# Altium project MachSacXa.PrjPcb
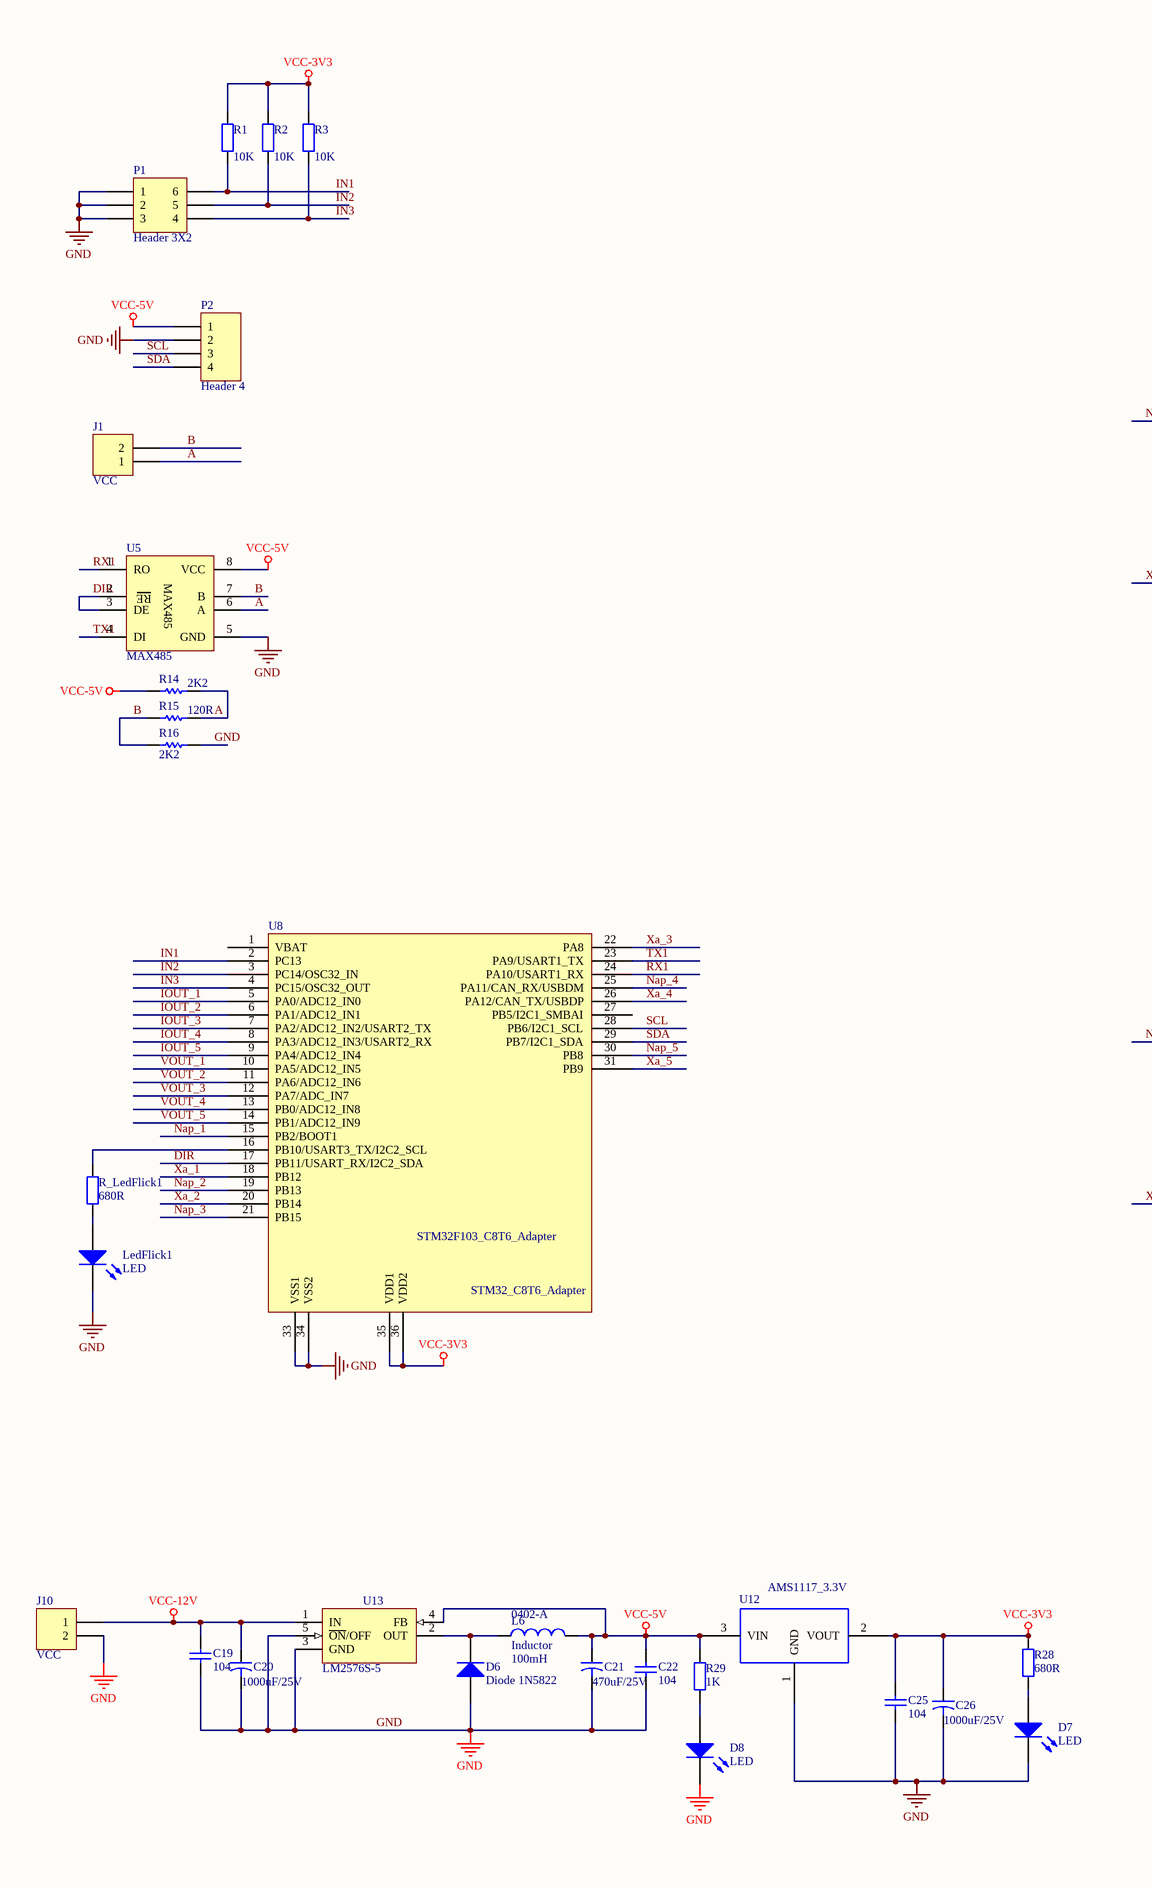
[diagram p0: MachSacXa.SchDoc, left]
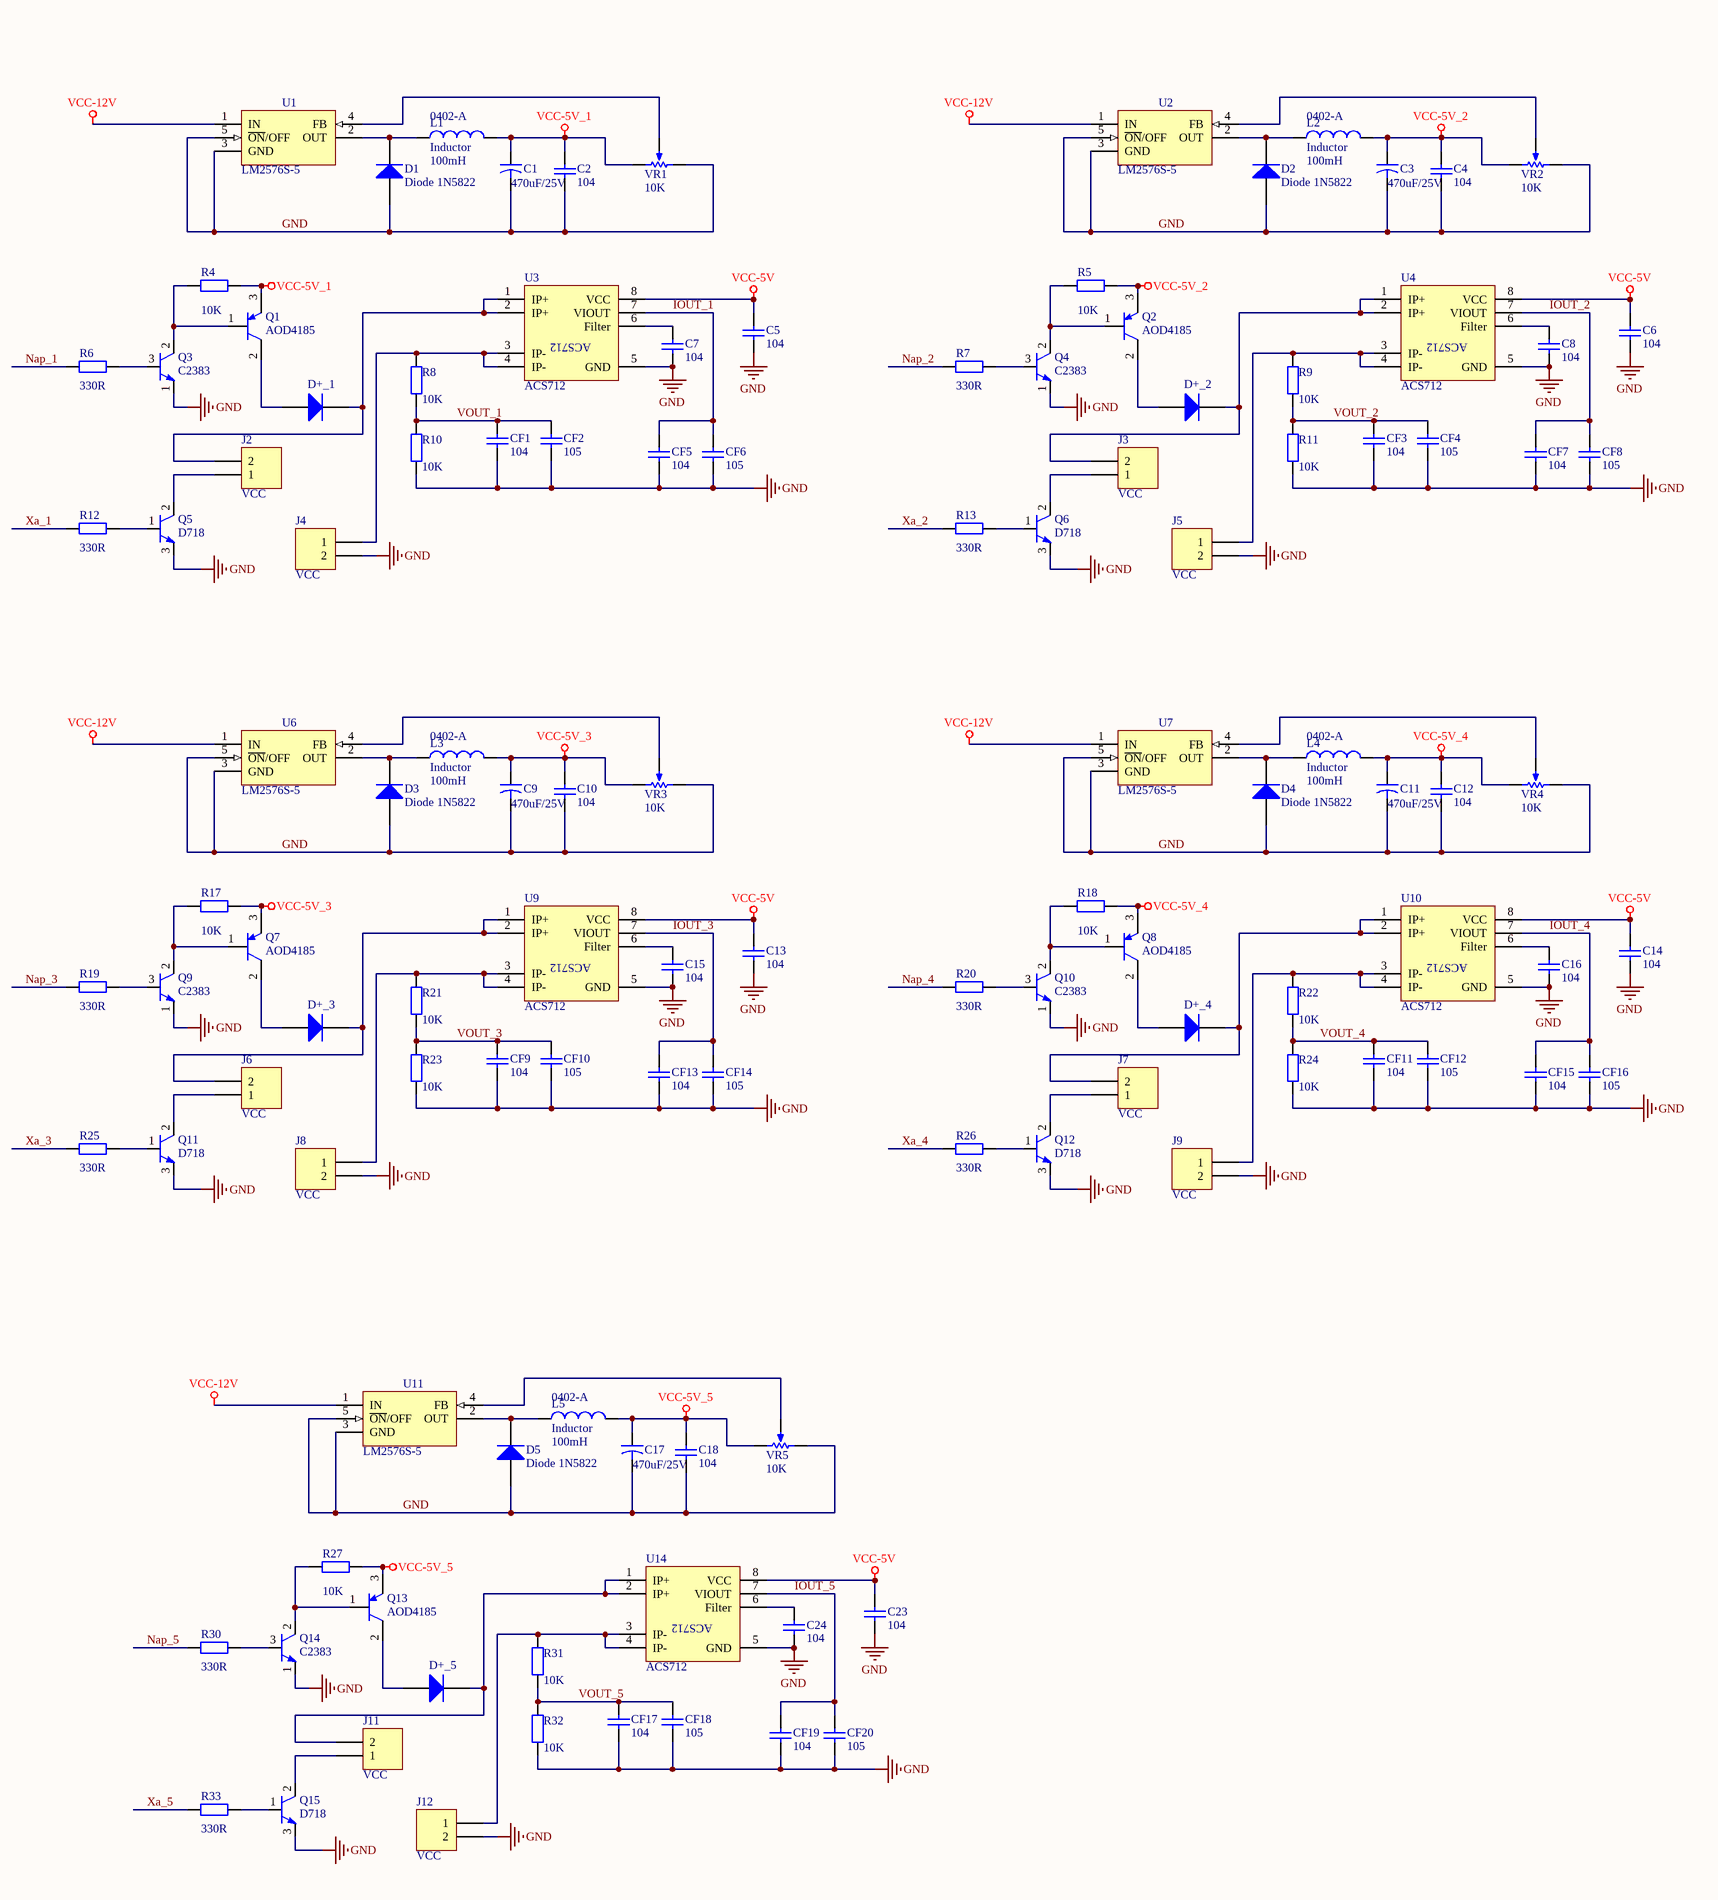
[diagram p1: MachSacXa.SchDoc, right]
1 sheet, 148 parts. Net scope: global (net labels, ports and power ports of the same name join across sheets).
Board file: MachSacXa.PcbDoc

## Sheet MachSacXa.SchDoc
size A2

### Parts
C1  value 470uF/25V  [C_D300]
C2  104  [R/C_0805]
C3  value 470uF/25V  [C_D300]
C4  104  [R/C_0805]
C5  104  [R/C_0805]
C6  104  [R/C_0805]
C7  104  [R/C_0805]
C8  104  [R/C_0805]
C9  value 470uF/25V  [C_D300]
C10  104  [R/C_0805]
C11  value 470uF/25V  [C_D300]
C12  104  [R/C_0805]
C13  104  [R/C_0805]
C14  104  [R/C_0805]
C15  104  [R/C_0805]
C16  104  [R/C_0805]
C17  value 470uF/25V  [C_D300]
C18  104  [R/C_0805]
C19  104  [R/C_0805]
C20  value 1000uF/25V  [C_D300]
C21  value 470uF/25V  [C_D300]
C22  104  [R/C_0805]
C23  104  [R/C_0805]
C24  104  [R/C_0805]
C25  104  [R/C_0805]
C26  value 1000uF/25V  [C_D300]
CF1  104  [R/C_0805]
CF2  105  [R/C_0805]
CF3  104  [R/C_0805]
CF4  105  [R/C_0805]
CF5  104  [R/C_0805]
CF6  105  [R/C_0805]
CF7  104  [R/C_0805]
CF8  105  [R/C_0805]
CF9  104  [R/C_0805]
CF10  105  [R/C_0805]
CF11  104  [R/C_0805]
CF12  105  [R/C_0805]
CF13  104  [R/C_0805]
CF14  105  [R/C_0805]
CF15  104  [R/C_0805]
CF16  105  [R/C_0805]
CF17  104  [R/C_0805]
CF18  105  [R/C_0805]
CF19  104  [R/C_0805]
CF20  105  [R/C_0805]
D1  Diode 1N5822  [Diode_1A]
D2  Diode 1N5822  [Diode_1A]
D3  Diode 1N5822  [Diode_1A]
D4  Diode 1N5822  [Diode_1A]
D5  Diode 1N5822  [Diode_1A]
D6  Diode 1N5822  [Diode_1A]
D7  LED  [LED_SMD (0805)]
D8  LED  [LED_SMD (0805)]
D+_1  Diode 1N5822  [Diode_1A]  (value not drawn)
D+_2  Diode 1N5822  [Diode_1A]  (value not drawn)
D+_3  Diode 1N5822  [Diode_1A]  (value not drawn)
D+_4  Diode 1N5822  [Diode_1A]  (value not drawn)
D+_5  Diode 1N5822  [Diode_1A]  (value not drawn)
J1  VCC  [HEADER1_2(400)]
J2  VCC  [HEADER1_2(400)]
J3  VCC  [HEADER1_2(400)]
J4  VCC  [HEADER1_2(400)]
J5  VCC  [HEADER1_2(400)]
J6  VCC  [HEADER1_2(400)]
J7  VCC  [HEADER1_2(400)]
J8  VCC  [HEADER1_2(400)]
J9  VCC  [HEADER1_2(400)]
J10  VCC  [HEADER1_2(400)]
J11  VCC  [HEADER1_2(400)]
J12  VCC  [HEADER1_2(400)]
L1  Inductor  value 100mH  PackageReference: 0402-A  [Cuon_cam(100mH)]
L2  Inductor  value 100mH  PackageReference: 0402-A  [Cuon_cam(100mH)]
L3  Inductor  value 100mH  PackageReference: 0402-A  [Cuon_cam(100mH)]
L4  Inductor  value 100mH  PackageReference: 0402-A  [Cuon_cam(100mH)]
L5  Inductor  value 100mH  PackageReference: 0402-A  [Cuon_cam(100mH)]
L6  Inductor  value 100mH  PackageReference: 0402-A  [Cuon_cam(100mH)]
LedFlick1  LED  [LED_SMD (0805)]
P1  Header 3X2  [DIP6_300]
P2  Header 4  [CON-Trang1_4]
Q1  value AOD4185  [AOD4185]  (hidden comment: NPN_ECB)
Q2  value AOD4185  [AOD4185]  (hidden comment: NPN_ECB)
Q3  value C2383  [C1815/C945]  (hidden comment: TR_NPN_ECB)
Q4  value C2383  [C1815/C945]  (hidden comment: TR_NPN_ECB)
Q5  value D718  [D718]  (hidden comment: TR_NPN_D718)
Q6  value D718  [D718]  (hidden comment: TR_NPN_D718)
Q7  value AOD4185  [AOD4185]  (hidden comment: NPN_ECB)
Q8  value AOD4185  [AOD4185]  (hidden comment: NPN_ECB)
Q9  value C2383  [C1815/C945]  (hidden comment: TR_NPN_ECB)
Q10  value C2383  [C1815/C945]  (hidden comment: TR_NPN_ECB)
Q11  value D718  [D718]  (hidden comment: TR_NPN_D718)
Q12  value D718  [D718]  (hidden comment: TR_NPN_D718)
Q13  value AOD4185  [AOD4185]  (hidden comment: NPN_ECB)
Q14  value C2383  [C1815/C945]  (hidden comment: TR_NPN_ECB)
Q15  value D718  [D718]  (hidden comment: TR_NPN_D718)
R1  value 10K  [R/C_0805]
R2  value 10K  [R/C_0805]
R3  value 10K  [R/C_0805]
R4  value 10K  [R/C_0805]
R5  value 10K  [R/C_0805]
R6  value 330R  [R/C_0805]
R7  value 330R  [R/C_0805]
R8  value 10K  [R/C_0805]
R9  value 10K  [R/C_0805]
R10  value 10K  [R/C_0805]
R11  value 10K  [R/C_0805]
R12  value 330R  [R/C_0805]
R13  value 330R  [R/C_0805]
R14  value 2K2  [R/C_0805]  (hidden comment: Res1)
R15  value 120R  [R/C_0805]  (hidden comment: Res1)
R16  value 2K2  [R/C_0805]  (hidden comment: Res1)
R17  value 10K  [R/C_0805]
R18  value 10K  [R/C_0805]
R19  value 330R  [R/C_0805]
R20  value 330R  [R/C_0805]
R21  value 10K  [R/C_0805]
R22  value 10K  [R/C_0805]
R23  value 10K  [R/C_0805]
R24  value 10K  [R/C_0805]
R25  value 330R  [R/C_0805]
R26  value 330R  [R/C_0805]
R27  value 10K  [R/C_0805]
R28  value 680R  [R/C_0805]
R29  value 1K  [R/C_0805]
R30  value 330R  [R/C_0805]
R31  value 10K  [R/C_0805]
R32  value 10K  [R/C_0805]
R33  value 330R  [R/C_0805]
R_LedFlick1  value 680R  [R/C_0805]
U1  LM2576S-5  [LM2576(1)]
U2  LM2576S-5  [LM2576(1)]
U3  ACS712  [DS1307]
U4  ACS712  [DS1307]
U5  MAX485  [DIP8_300]
U6  LM2576S-5  [LM2576(1)]
U7  LM2576S-5  [LM2576(1)]
U8  STM32F103_C8T6_Adapter  [Dip36(9x4)]
U9  ACS712  [DS1307]
U10  ACS712  [DS1307]
U11  LM2576S-5  [LM2576(1)]
U12  AMS1117_3.3V  [AMS1117_(SOT_223)]
U13  LM2576S-5  [LM2576]
U14  ACS712  [DS1307]
VR1  value 10K  [VR_3]  (hidden comment: Bien tro)
VR2  value 10K  [VR_3]  (hidden comment: Bien tro)
VR3  value 10K  [VR_3]  (hidden comment: Bien tro)
VR4  value 10K  [VR_3]  (hidden comment: Bien tro)
VR5  value 10K  [VR_3]  (hidden comment: Bien tro)

### Nets
GND: C1.2 C2.2 C3.2 C4.2 C5.2 C6.2 C7.2 C8.2 C9.2 C10.2 C11.2 C12.2 C13.2 C14.2 C15.2 C16.2 C17.2 C18.2 C19.2 C20.2 C21.2 C22.2 C23.2 C24.2 C25.2 C26.2 CF1.2 CF2.2 CF3.2 CF4.2 CF5.2 CF6.2 CF7.2 CF8.2 CF9.2 CF10.2 CF11.2 CF12.2 CF13.2 CF14.2 CF15.2 CF16.2 CF17.2 CF18.2 CF19.2 CF20.2 D1.1(A) D2.1(A) D3.1(A) D4.1(A) D5.1(A) D6.1(A) D7.2(K) D8.2(K) J4.2 J5.2 J8.2 J9.2 J10.2 J12.2 LedFlick1.2(K) P1.1 P1.2 P1.3 P2.2 Q3.1(E) Q4.1(E) Q5.3(B) Q6.3(B) Q9.1(E) Q10.1(E) Q11.3(B) Q12.3(B) Q14.1(E) Q15.3(B) R10.1 R11.1 R16.1 R23.1 R24.1 R32.1 U1.3(GND) U1.5(~{ON}/OFF) U2.3(GND) U2.5(~{ON}/OFF) U3.5(GND) U4.5(GND) U5.5(GND) U6.3(GND) U6.5(~{ON}/OFF) U7.3(GND) U7.5(~{ON}/OFF) U8.33(VSS1) U8.34(VSS2) U9.5(GND) U10.5(GND) U11.3(GND) U11.5(~{ON}/OFF) U12.1(GND) U13.3(GND) U13.5(~{ON}/OFF) U14.5(GND) VR1.1(TOP) VR2.1(TOP) VR3.1(TOP) VR4.1(TOP) VR5.1(TOP)
VCC-3V3: C25.1 C26.1 R1.2 R2.2 R3.2 R28.1 U8.35(VDD1) U8.36(VDD2) U12.2(VOUT)
VCC-5V: C5.1 C6.1 C13.1 C14.1 C21.1 C22.1 C23.1 L6.2 P2.1 R14.2 R29.1 U3.8(VCC) U4.8(VCC) U5.8(VCC) U9.8(VCC) U10.8(VCC) U12.3(VIN) U13.4(FB) U14.8(VCC)
VCC-5V_1: C1.1 C2.1 L1.2 Q1.3(C) R4.1 VR1.3(TAP)
VCC-5V_2: C3.1 C4.1 L2.2 Q2.3(C) R5.1 VR2.3(TAP)
VCC-5V_3: C9.1 C10.1 L3.2 Q7.3(C) R17.1 VR3.3(TAP)
VCC-5V_4: C11.1 C12.1 L4.2 Q8.3(C) R18.1 VR4.3(TAP)
VCC-5V_5: C17.1 C18.1 L5.2 Q13.3(C) R27.1 VR5.3(TAP)
VCC-12V: C19.1 C20.1 J10.1 U1.1(IN) U2.1(IN) U6.1(IN) U7.1(IN) U11.1(IN) U13.1(IN)
A: J1.1 R14.1 R15.1 U5.6(A)
B: J1.2 R15.2 R16.2 U5.7(B)
DIR: U5.2 U5.3(DE) U8.17(PB11/USART_RX/I2C2_SDA)
IN1: P1.6 R1.1 U8.2(PC13)
IN2: P1.5 R2.1 U8.3(PC14/OSC32_IN)
IN3: P1.4 R3.1 U8.4(PC15/OSC32_OUT)
IOUT_1: CF5.1 CF6.1 U3.7(VIOUT) U8.5(PA0/ADC12_IN0)
IOUT_2: CF7.1 CF8.1 U4.7(VIOUT) U8.6(PA1/ADC12_IN1)
IOUT_3: CF13.1 CF14.1 U8.7(PA2/ADC12_IN2/USART2_TX) U9.7(VIOUT)
IOUT_4: CF15.1 CF16.1 U8.8(PA3/ADC12_IN3/USART2_RX) U10.7(VIOUT)
IOUT_5: CF19.1 CF20.1 U8.9(PA4/ADC12_IN4) U14.7(VIOUT)
Nap_1: R6.1 U8.15(PB2/BOOT1)
Nap_2: R7.1 U8.19(PB13)
Nap_3: R19.1 U8.21(PB15)
Nap_4: R20.1 U8.25(PA11/CAN_RX/USBDM)
Nap_5: R30.1 U8.30(PB8)
RX1: U5.1(RO) U8.24(PA10/USART1_RX)
SCL: P2.3 U8.28(PB6/I2C1_SCL)
SDA: P2.4 U8.29(PB7/I2C1_SDA)
TX1: U5.4(DI) U8.23(PA9/USART1_TX)
VOUT_1: CF1.1 CF2.1 R8.1 R10.2 U8.10(PA5/ADC12_IN5)
VOUT_2: CF3.1 CF4.1 R9.1 R11.2 U8.11(PA6/ADC12_IN6)
VOUT_3: CF9.1 CF10.1 R21.1 R23.2 U8.12(PA7/ADC_IN7)
VOUT_4: CF11.1 CF12.1 R22.1 R24.2 U8.13(PB0/ADC12_IN8)
VOUT_5: CF17.1 CF18.1 R31.1 R32.2 U8.14(PB1/ADC12_IN9)
Xa_1: R12.1 U8.18(PB12)
Xa_2: R13.1 U8.20(PB14)
Xa_3: R25.1 U8.22(PA8)
Xa_4: R26.1 U8.26(PA12/CAN_TX/USBDP)
Xa_5: R33.1 U8.31(PB9)
NetC7_1: C7.1 U3.6(Filter)
NetC8_1: C8.1 U4.6(Filter)
NetC15_1: C15.1 U9.6(Filter)
NetC16_1: C16.1 U10.6(Filter)
NetC24_1: C24.1 U14.6(Filter)
NetD1_2: D1.2(K) L1.1 U1.2(OUT)
NetD2_2: D2.2(K) L2.1 U2.2(OUT)
NetD3_2: D3.2(K) L3.1 U6.2(OUT)
NetD4_2: D4.2(K) L4.1 U7.2(OUT)
NetD5_2: D5.2(K) L5.1 U11.2(OUT)
NetD6_2: D6.2(K) L6.1 U13.2(OUT)
NetD7_1: D7.1(A) R28.2
NetD8_1: D8.1(A) R29.2
NetD+_1_1: D+_1.1(A) Q1.2(E)
NetD+_1_2: D+_1.2(K) J2.2 U3.1(IP+) U3.2(IP+)
NetD+_2_1: D+_2.1(A) Q2.2(E)
NetD+_2_2: D+_2.2(K) J3.2 U4.1(IP+) U4.2(IP+)
NetD+_3_1: D+_3.1(A) Q7.2(E)
NetD+_3_2: D+_3.2(K) J6.2 U9.1(IP+) U9.2(IP+)
NetD+_4_1: D+_4.1(A) Q8.2(E)
NetD+_4_2: D+_4.2(K) J7.2 U10.1(IP+) U10.2(IP+)
NetD+_5_1: D+_5.1(A) Q13.2(E)
NetD+_5_2: D+_5.2(K) J11.2 U14.1(IP+) U14.2(IP+)
NetJ2_1: J2.1 Q5.2(C)
NetJ3_1: J3.1 Q6.2(C)
NetJ4_1: J4.1 R8.2 U3.3(IP-) U3.4(IP-)
NetJ5_1: J5.1 R9.2 U4.3(IP-) U4.4(IP-)
NetJ6_1: J6.1 Q11.2(C)
NetJ7_1: J7.1 Q12.2(C)
NetJ8_1: J8.1 R21.2 U9.3(IP-) U9.4(IP-)
NetJ9_1: J9.1 R22.2 U10.3(IP-) U10.4(IP-)
NetJ11_1: J11.1 Q15.2(C)
NetJ12_1: J12.1 R31.2 U14.3(IP-) U14.4(IP-)
NetLedFlick1_1: LedFlick1.1(A) R_LedFlick1.2
NetQ1_1: Q1.1(B) Q3.2(C) R4.2
NetQ2_1: Q2.1(B) Q4.2(C) R5.2
NetQ3_3: Q3.3(B) R6.2
NetQ4_3: Q4.3(B) R7.2
NetQ5_1: Q5.1(E) R12.2
NetQ6_1: Q6.1(E) R13.2
NetQ7_1: Q7.1(B) Q9.2(C) R17.2
NetQ8_1: Q8.1(B) Q10.2(C) R18.2
NetQ9_3: Q9.3(B) R19.2
NetQ10_3: Q10.3(B) R20.2
NetQ11_1: Q11.1(E) R25.2
NetQ12_1: Q12.1(E) R26.2
NetQ13_1: Q13.1(B) Q14.2(C) R27.2
NetQ14_3: Q14.3(B) R30.2
NetQ15_1: Q15.1(E) R33.2
NetR_LedFlick1_1: R_LedFlick1.1 U8.16(PB10/USART3_TX/I2C2_SCL)
NetU1_4: U1.4(FB) VR1.2(BOT)
NetU2_4: U2.4(FB) VR2.2(BOT)
NetU6_4: U6.4(FB) VR3.2(BOT)
NetU7_4: U7.4(FB) VR4.2(BOT)
NetU11_4: U11.4(FB) VR5.2(BOT)

Not connected (* = marked no-connect by the designer): U8 1(VBAT) 27(PB5/I2C1_SMBAI)

### Notes on the sheet
- (in symbol MAX485) RE

### Library data of the parts
C1 C3 C9 C11 C17 C20 C21 C26 = Cap2: Capacitor; Published: 23-Sep-2002; PackageReference: CAPR5-4X5; Publisher: Altium Limited
C2 C4-C8 C10 C12-C16 C18 C19 C22-C25 CF1-CF20 = Cap: Capacitor; Value: 100pF; Published: 8-Jun-2000; LatestRevisionDate: 17-Jul-2002; LatestRevisionNote: Re-released for DXP Platform.; PackageReference: RAD-0.3; Publisher: Altium Limited
D1-D6 D+_1-D+_5 = Diode 1N4004: 1 Amp General Purpose Rectifier; Published: 8-Jun-2000; LatestRevisionDate: 17-Jul-2002; LatestRevisionNote: Re-released for DXP Platform.; DatasheetDocument: 1998; PackageDocument: Aug-1999; PackageReference: DO-41; Publisher: Altium Limited; Code_JEDEC: DO-204-AL; ComponentLink1Description: Manufacturer Link; ComponentLink1URL: http://www.fairchildsemi.com/; ComponentLink2Description: Datasheet; ComponentLink2URL: http://www.fairchildsemi.com/ds/1N%2F1N4001.pdf
D7 D8 LedFlick1 = LED0: Typical INFRARED GaAs LED; Published: 8-Jun-2000; LatestRevisionDate: 08-Jul-2005; LatestRevisionNote: Mech Layer 1 removed.; PackageReference: LED-0; Publisher: Altium Limited
J1-J12 = Header 2: Header, 2-Pin; LatestRevisionDate: 17-Jul-2002; LatestRevisionNote: Re-released for DXP Platform.; Publisher: Altium Limited
L1-L6 = Inductor: Code_IEC: 1005; Published: 8-Jun-2000; LatestRevisionDate: 17-Jul-2002; LatestRevisionNote: Re-released for DXP Platform.; Publisher: Altium Limited; Code_JEITA: 0402
P1 = Header 3X2: Header, 3-Pin, Dual row; LatestRevisionDate: 17-Jul-2002; LatestRevisionNote: Re-released for DXP Platform.; Publisher: Altium Limited
P2 = Header 4: Header, 4-Pin; LatestRevisionDate: 17-Jul-2002; LatestRevisionNote: Re-released for DXP Platform.; Publisher: Altium Limited
Q1 Q2 Q7 Q8 Q13 = TR_PNP_ECB
R1-R13 R17-R33 R_LedFlick1 = Res2: Resistor; Published: 8-Jun-2000; LatestRevisionDate: 17-Jul-2002; LatestRevisionNote: Re-released for DXP Platform.; PackageReference: AXIAL-0.4; Publisher: Altium Limited
R14-R16 = Res1: Resistor; Published: 8-Jun-2000; LatestRevisionDate: 17-Jul-2002; LatestRevisionNote: Re-released for DXP Platform.; PackageReference: AXIAL-0.3; Publisher: Altium Limited
U1 U2 U6 U7 U11 U13 = LM2576S-5.0: Simple Switcher 3A Step Down Voltage Regulator; Note: Tab is connected to GND; Published: 15-Apr-2002; DatasheetVersion: Jun-1999; PackageReference: TS5B; Publisher: Altium Limited; PackageDescription: D2-PAK; 5 Leads; Body 14.4 (inc. leads) x 10.4 mm (LxW max); ComponentLink1Description: Manufacturer Link; ComponentLink1URL: http://www.national.com/; ComponentLink2Description: Datasheet; ComponentLink2URL: http://www.national.com/ds.cgi/LM/LM2576.pdf; ComponentLink3Description: URL Link1; ComponentLink3URL: http://www.national.com/pf/LM/LM2576.html
U8 = STM32_C8T6_Adapter
VR1-VR5 = VR